# Altium schematic sheet MRF24J40MA_SHIELD.SchDoc
size A
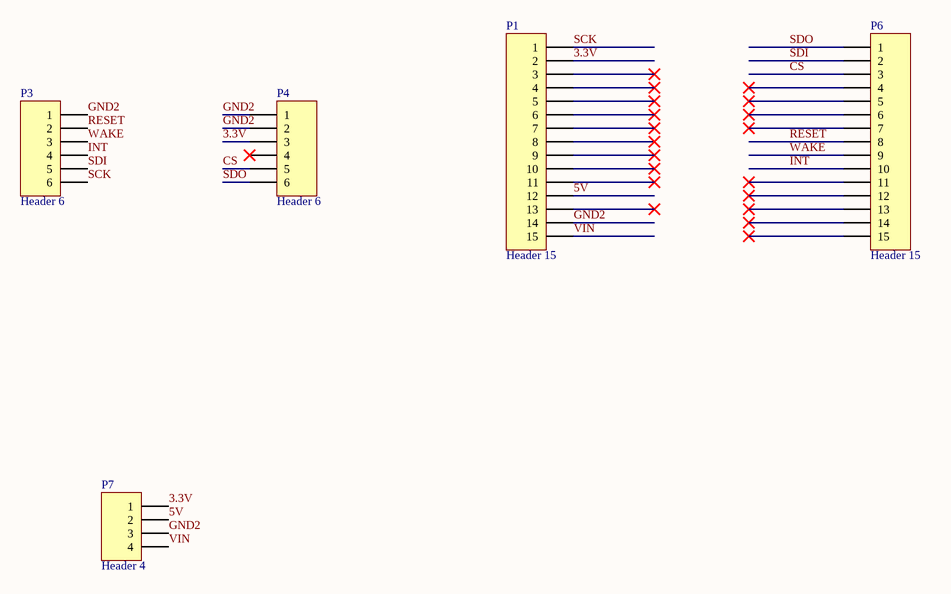
[diagram p0: MRF24J40MA_SHIELD.SchDoc]

## Parts
P1  Header 15  [HDR1X15]
P3  Header 6  [HDR1X6]
P4  Header 6  [HDR1X6]
P6  Header 15  [HDR1X15]
P7  Header 4  [HDR1X4]

## Nets
3.3V: P1.2 P4.3 P7.1
5V: P1.12 P7.2
CS: P4.5 P6.3
GND2: P1.14 P3.1 P4.1 P4.2 P7.3
INT: P3.4 P6.10
RESET: P3.2 P6.8
SCK: P1.1 P3.6
SDI: P3.5 P6.2
SDO: P4.6 P6.1
VIN: P1.15 P7.4
WAKE: P3.3 P6.9

Not connected (* = marked no-connect by the designer): P1 3* 4* 5* 6* 7* 8* 9* 10* 11* 13*; P4 4*; P6 4* 5* 6* 7* 11* 12* 13* 14* 15*

## Library data of the parts
P1 P6 = Header 15: Header, 15-Pin; LatestRevisionDate: 17-Jul-2002; LatestRevisionNote: Re-released for DXP Platform.; Publisher: Altium Limited
P3 P4 = Header 6: Header, 6-Pin; LatestRevisionDate: 17-Jul-2002; LatestRevisionNote: Re-released for DXP Platform.; Publisher: Altium Limited
P7 = Header 4: Header, 4-Pin; LatestRevisionDate: 17-Jul-2002; LatestRevisionNote: Re-released for DXP Platform.; Publisher: Altium Limited